# Altium project reservoir_level_color.PrjPcb
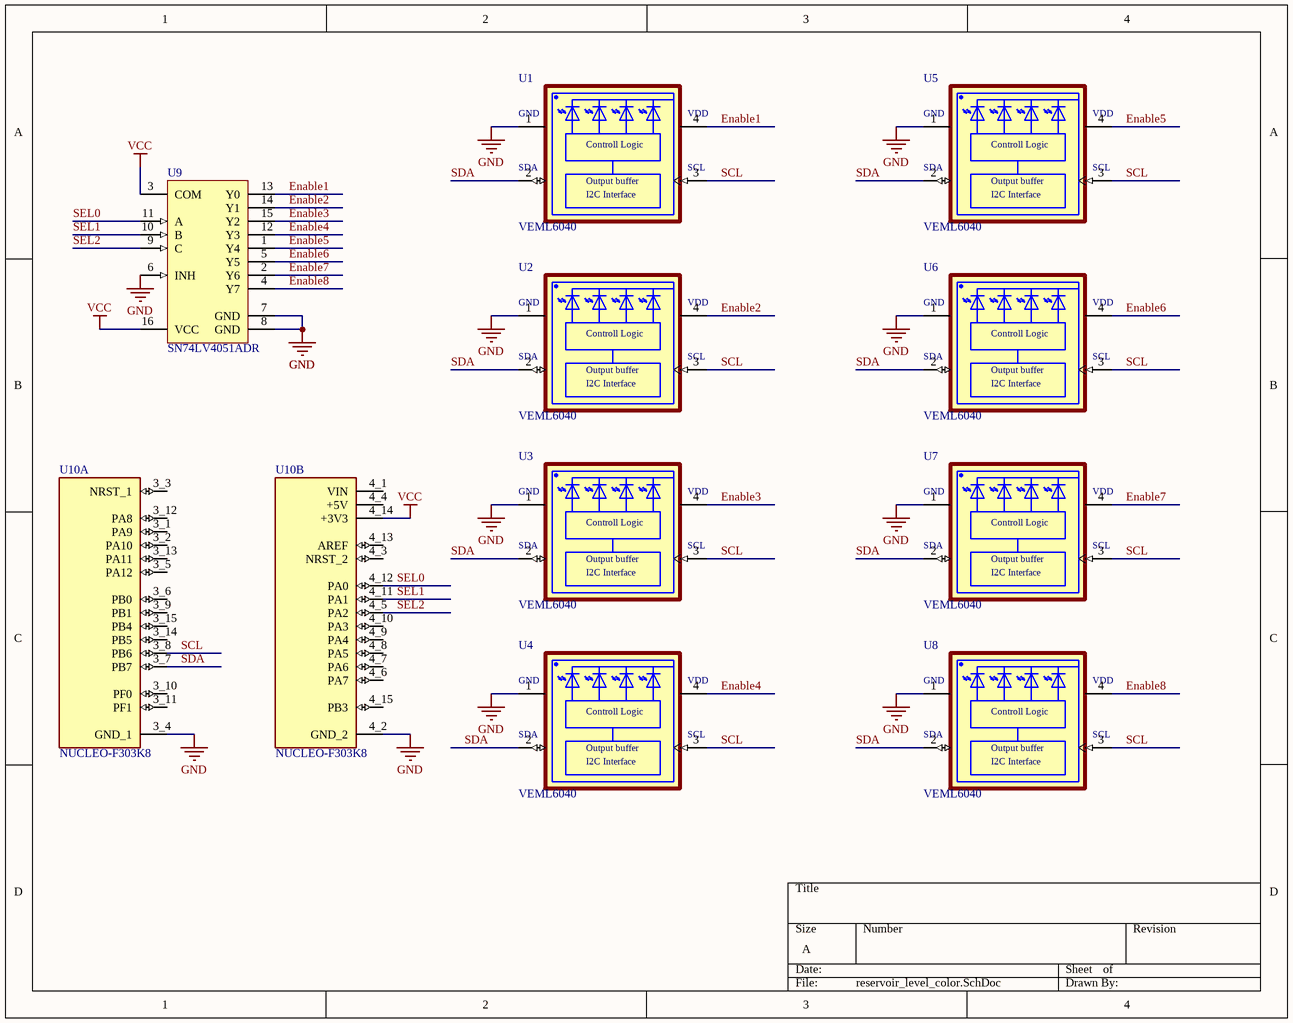
[diagram p0: reservoir_level_color.SchDoc]
2 sheets, 19 parts. Net scope: global (net labels, ports and power ports of the same name join across sheets).
Board file: reservoir_level_color.PcbDoc
Sheets:
  reservoir_level_color.SchDoc
  color_sensors.SchDoc

## Sheet reservoir_level_color.SchDoc
size A; SheetNumber: 1; SheetTotal: 1

### Parts
U1  VEML6040  [VISHAY_VEML6040_1.25X2X1]
U2  VEML6040  [VISHAY_VEML6040_1.25X2X1]
U3  VEML6040  [VISHAY_VEML6040_1.25X2X1]
U4  VEML6040  [VISHAY_VEML6040_1.25X2X1]
U5  VEML6040  [VISHAY_VEML6040_1.25X2X1]
U6  VEML6040  [VISHAY_VEML6040_1.25X2X1]
U7  VEML6040  [VISHAY_VEML6040_1.25X2X1]
U8  VEML6040  [VISHAY_VEML6040_1.25X2X1]
U9  SN74LV4051ADR  [D0016A_M]
U10  NUCLEO-F303K8  [MODULE_NUCLEO-F303K8]  (parts A,B of 2)

### Nets
GND: U1.1(GND) U2.1(GND) U3.1(GND) U4.1(GND) U5.1(GND) U6.1(GND) U7.1(GND) U8.1(GND) U9.6(INH) U9.7(GND) U9.8(GND) U10.3_4(GND_1) U10.4_2(GND_2)
VCC: U9.3(COM) U9.16(VCC) U10.4_14(+3V3)
Enable1: U1.4(VDD) U9.13(Y0)
Enable2: U2.4(VDD) U9.14(Y1)
Enable3: U3.4(VDD) U9.15(Y2)
Enable4: U4.4(VDD) U9.12(Y3)
Enable5: U5.4(VDD) U9.1(Y4)
Enable6: U6.4(VDD) U9.5(Y5)
Enable7: U7.4(VDD) U9.2(Y6)
Enable8: U8.4(VDD) U9.4(Y7)
SCL: U1.3(SCL) U2.3(SCL) U3.3(SCL) U4.3(SCL) U5.3(SCL) U6.3(SCL) U7.3(SCL) U8.3(SCL) U10.3_8(PB6)
SDA: U1.2(SDA) U2.2(SDA) U3.2(SDA) U4.2(SDA) U5.2(SDA) U6.2(SDA) U7.2(SDA) U8.2(SDA) U10.3_7(PB7)
SEL0: U9.11(A) U10.4_12(PA0)
SEL1: U9.10(B) U10.4_11(PA1)
SEL2: U9.9(C) U10.4_5(PA2)

Not connected (* = marked no-connect by the designer): U10 3_1(PA9) 3_2(PA10) 3_3(NRST_1) 3_5(PA12) 3_6(PB0) 3_9(PB1) 3_10(PF0) 3_11(PF1) 3_12(PA8) 3_13(PA11) 3_14(PB5) 3_15(PB4) 4_1(VIN) 4_3(NRST_2) 4_4(+5V) 4_6(PA7) 4_7(PA6) 4_8(PA5) 4_9(PA4) 4_10(PA3) 4_13(AREF) 4_15(PB3)

### Notes on the sheet
- (in symbol VEML6040) Controll Logic; Output buffer; I2C Interface

### Library data of the parts
U1-U8 = VEML6040: <b>VEML6040</b>  <p> RGBW Color Sensor with I2C Interface: <ul>   VEML6040 color sensor senses red, green, blue, and white light and incorporates photodiodes, amplifiers, and analog / digital circuits into a single chip using CMOS process. With the color sensor applied, the brightness, and color temperature of backlight can be adjusted base on ambient light source that makes panel looks more comfortable for end userâ€™s eyes. VEML6040â€™s adoption of FiltronTM technology achieves the closest ambient light spectral sensitivity to real human eye responses.  <ul> Device Model created 15.06.2016 by Johannes Kolb - Vishay Semiconductor GmbH; MF: {'manufacturer': u'Vishay'}; Price: None; Availability: Unavailable; Package: None; Value: *; MP: VEML6040
U9 = CMP-0802-00006-4: 8-Channel Analog Multiplexer/Demultiplexer, D0016A, LARGE T&R; Manufacturer: Texas Instruments; VCC(Min)(V): 2; Output Type: CMOS; VCC(Max)(V): 5.5; Bandwidth(Max)(MHz): 35; Rating: Catalog; Configuration: 1 X 1：8 MUX; Crosstalk: Yes; Ron(Max)(Ohms): 75; Ron(Typ)(Ohms): 22; PackageVersion: http://www.ti.com/lit/ml/mpds178g/mpds178g.pdf; Generic Part Number: SN74LV4051A; Operating Temperature Range(C): -40 to 85; Code_JEDEC: MS-012 variation AC; PackageReference: D0016A; DatasheetVersion: SCLS428H
U10 = NUCLEO-F303K8: MF: {'manufacturer': u'STMicroelectronics'}; Package: None; MP: NUCLEO-F303K8; Price: None; Value: *; Availability: Unavailable

## Sheet color_sensors.SchDoc
size A; SheetNumber: 2; SheetTotal: 2
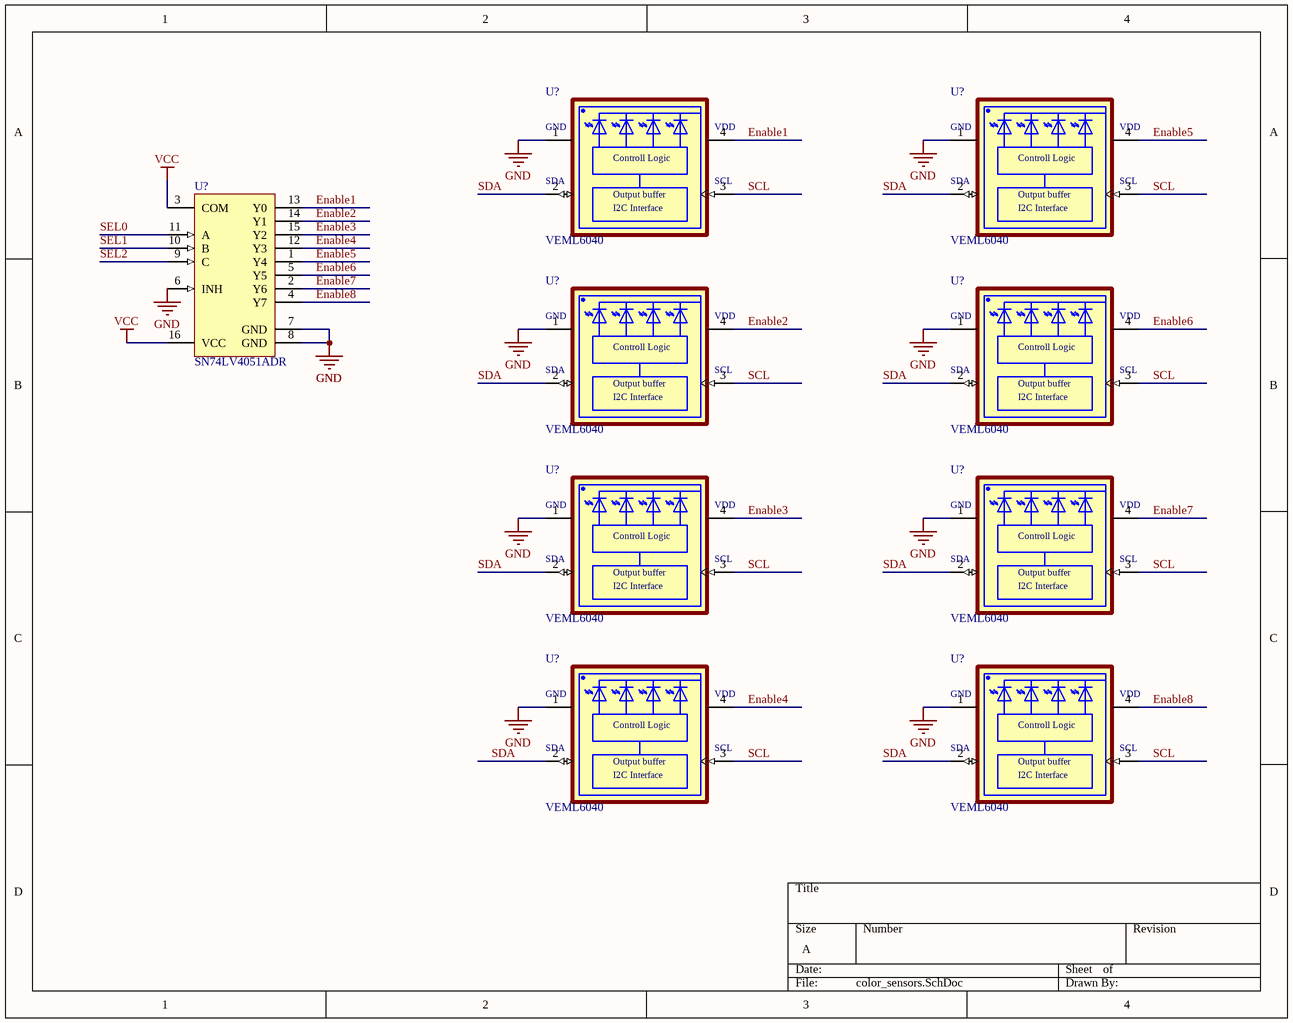
[diagram p1: color_sensors.SchDoc]

### Parts
(Parts that share a designator on the sheet are numbered #1, #2 ... from top to bottom, then left to right.)
U?#1  VEML6040  [VISHAY_VEML6040_1.25X2X1]
U?#2  VEML6040  [VISHAY_VEML6040_1.25X2X1]
U?#3  SN74LV4051ADR  [D0016A_M]
U?#4  VEML6040  [VISHAY_VEML6040_1.25X2X1]
U?#5  VEML6040  [VISHAY_VEML6040_1.25X2X1]
U?#6  VEML6040  [VISHAY_VEML6040_1.25X2X1]
U?#7  VEML6040  [VISHAY_VEML6040_1.25X2X1]
U?#8  VEML6040  [VISHAY_VEML6040_1.25X2X1]
U?#9  VEML6040  [VISHAY_VEML6040_1.25X2X1]

### Nets
GND: U?#1.1(GND) U?#2.1(GND) U?#3.6(INH) U?#3.7(GND) U?#3.8(GND) U?#4.1(GND) U?#5.1(GND) U?#6.1(GND) U?#7.1(GND) U?#8.1(GND) U?#9.1(GND)
VCC: U?#3.3(COM) U?#3.16(VCC)
Enable1: U?#1.4(VDD) U?#3.13(Y0)
Enable2: U?#3.14(Y1) U?#4.4(VDD)
Enable3: U?#3.15(Y2) U?#6.4(VDD)
Enable4: U?#3.12(Y3) U?#8.4(VDD)
Enable5: U?#2.4(VDD) U?#3.1(Y4)
Enable6: U?#3.5(Y5) U?#5.4(VDD)
Enable7: U?#3.2(Y6) U?#7.4(VDD)
Enable8: U?#3.4(Y7) U?#9.4(VDD)
SCL: U?#1.3(SCL) U?#2.3(SCL) U?#4.3(SCL) U?#5.3(SCL) U?#6.3(SCL) U?#7.3(SCL) U?#8.3(SCL) U?#9.3(SCL)
SDA: U?#1.2(SDA) U?#2.2(SDA) U?#4.2(SDA) U?#5.2(SDA) U?#6.2(SDA) U?#7.2(SDA) U?#8.2(SDA) U?#9.2(SDA)
SEL0: U?#3.11(A)
SEL1: U?#3.10(B)
SEL2: U?#3.9(C)

### Notes on the sheet
- (in symbol VEML6040) Controll Logic; Output buffer; I2C Interface

### Library data of the parts
U?#1 U?#2 U?#4-U?#9 = VEML6040: as U1 on sheet reservoir_level_color; Price: None; Availability: Unavailable; Package: None; Value: *; MP: VEML6040
U?#3 = CMP-0802-00006-4: as U9 on sheet reservoir_level_color; PackageVersion: http://www.ti.com/lit/ml/mpds178g/mpds178g.pdf; Generic Part Number: SN74LV4051A; Operating Temperature Range(C): -40 to 85; Code_JEDEC: MS-012 variation AC; PackageReference: D0016A; DatasheetVersion: SCLS428H

## Nets that join several sheets
GND: reservoir_level_color (13 pins), color_sensors (11 pins)
VCC: reservoir_level_color (U9.3 U9.16 U10.4_14), color_sensors (U?#3.3 U?#3.16)
Enable1: reservoir_level_color (U1.4 U9.13), color_sensors (U?#1.4 U?#3.13)
Enable2: reservoir_level_color (U2.4 U9.14), color_sensors (U?#3.14 U?#4.4)
Enable3: reservoir_level_color (U3.4 U9.15), color_sensors (U?#3.15 U?#6.4)
Enable4: reservoir_level_color (U4.4 U9.12), color_sensors (U?#3.12 U?#8.4)
Enable5: reservoir_level_color (U5.4 U9.1), color_sensors (U?#2.4 U?#3.1)
Enable6: reservoir_level_color (U6.4 U9.5), color_sensors (U?#3.5 U?#5.4)
Enable7: reservoir_level_color (U7.4 U9.2), color_sensors (U?#3.2 U?#7.4)
Enable8: reservoir_level_color (U8.4 U9.4), color_sensors (U?#3.4 U?#9.4)
SCL: reservoir_level_color (9 pins), color_sensors (8 pins)
SDA: reservoir_level_color (9 pins), color_sensors (8 pins)
SEL0: reservoir_level_color (U9.11 U10.4_12), color_sensors (U?#3.11)
SEL1: reservoir_level_color (U9.10 U10.4_11), color_sensors (U?#3.10)
SEL2: reservoir_level_color (U9.9 U10.4_5), color_sensors (U?#3.9)